# EAGLE schematic btle_board_R0_1 (EAGLE 6.6.0)
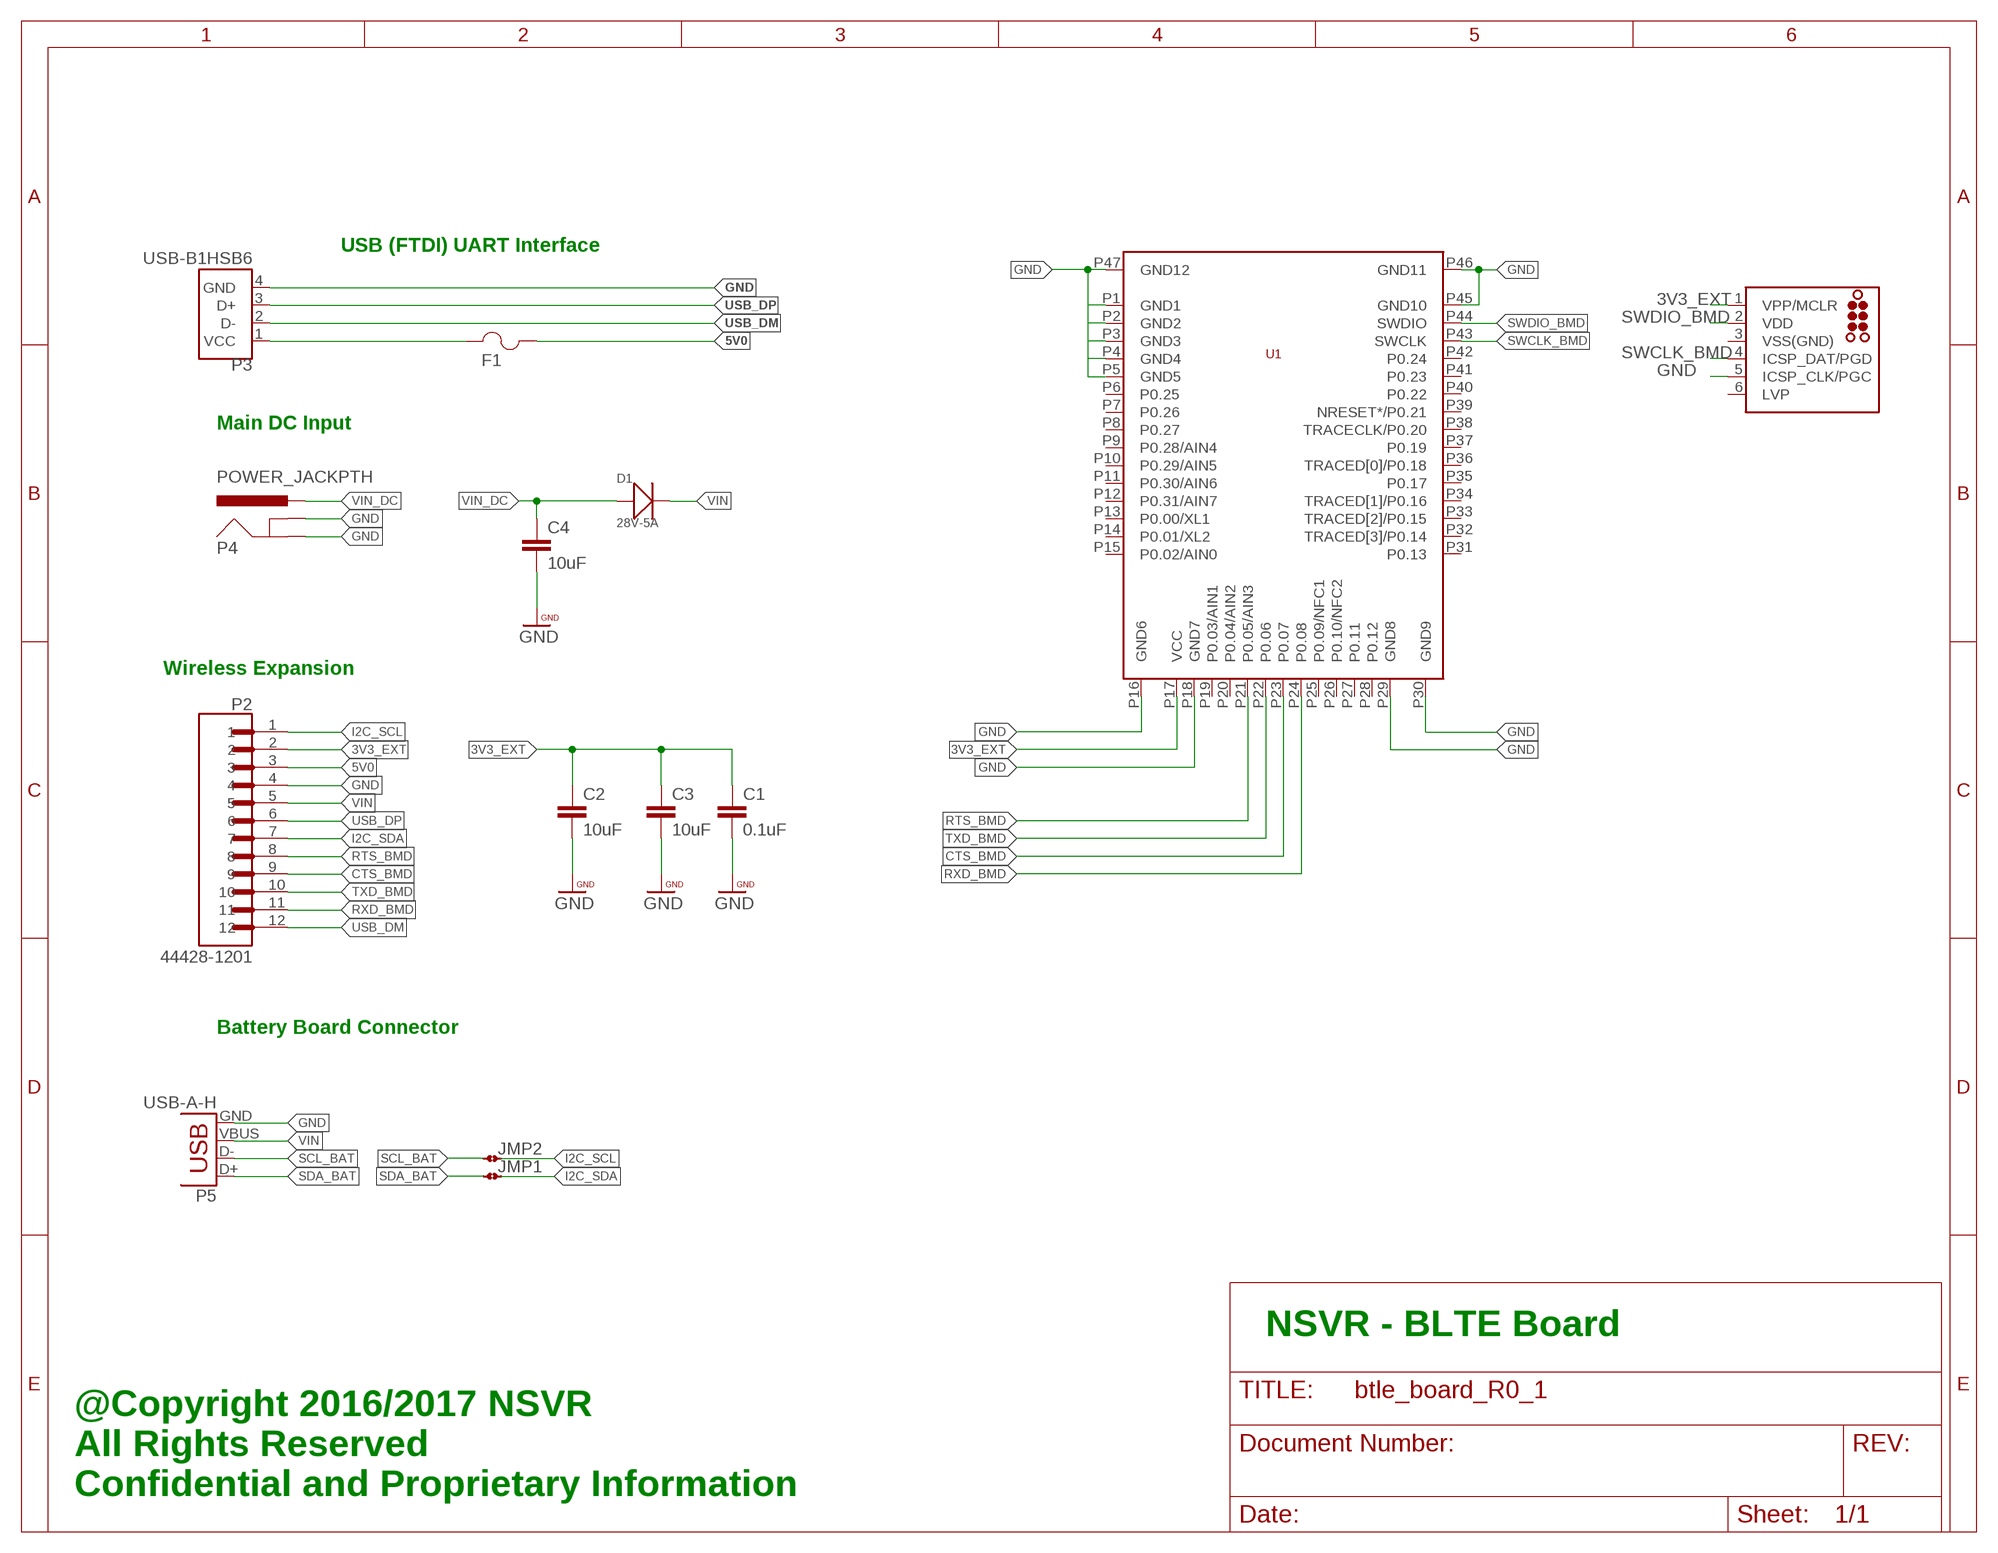
[diagram p0: schematic, sheet 1]

## Parts
C1  0.1uF  CAP0603-CAP  [0603-CAP]
C2  10uF  CAP0603-CAP  [0603-CAP]
C3  10uF  CAP0603-CAP  [0603-CAP]
C4  10uF  CAP0603-CAP  [0603-CAP]
D1  28V-5A  SMD-DIODE-SCHOTTKY-28V-5A(DO-214AA)  [DO-214AA]
F1  1206L050YR  [1206LSERIES]
JMP1  JMP-2-NO-0402  [JMP-2-NO-0402]
JMP2  JMP-2-NO-0402  [JMP-2-NO-0402]
P1  TC2030-MCP-NL  [TC2030-MCP-NL]
P2  44428-1201  [MOLEX_44428-1201]
P3  USB-B1HSB6  [OST_USB-B1HSB6]
P4  POWER_JACKPTH  [POWER_JACK_PTH]
P5  USB-A-H  [USB-A-H]
U1  BMD-300  [BMD-300]

## Nets
3V3_EXT: C1.1 C2.1 C3.1 P1.1(VPP/MCLR) P2.2 U1.P17(VCC)
5V0: F1.2 P2.3
CTS_BMD: P2.9 U1.P23(P0.07)
GND: C1.2 C2.2 C3.2 C4.2 P1.5(ICSP_CLK/PGC) P2.4 P3.4(GND) P4.GND P4.GNDBREAK P5.GND U1.P1(GND1) U1.P2(GND2) U1.P3(GND3) U1.P4(GND4) U1.P5(GND5) U1.P16(GND6) U1.P18(GND7) U1.P29(GND8) U1.P30(GND9) U1.P45(GND10) U1.P46(GND11) U1.P47(GND12)
I2C_SCL: JMP2.2 P2.1
I2C_SDA: JMP1.2 P2.7
RTS_BMD: P2.8 U1.P21(P0.05/AIN3)
RXD_BMD: P2.11 U1.P24(P0.08)
SCL_BAT: JMP2.1 P5.D-
SDA_BAT: JMP1.1 P5.D+
SWCLK_BMD: P1.4(ICSP_DAT/PGD) U1.P43(SWCLK)
SWDIO_BMD: P1.2(VDD) U1.P44(SWDIO)
TXD_BMD: P2.10 U1.P22(P0.06)
USB_DM: P2.12 P3.2(D-)
USB_DP: P2.6 P3.3(D+)
VBUS_IN: F1.1 P3.1(VCC)
VIN: D1.- P2.5 P5.VBUS
VIN_DC: C4.1 D1.+ P4.PWR
Unconnected: P1.6(LVP) U1.P6(P0.25) U1.P7(P0.26) U1.P8(P0.27) U1.P9(P0.28/AIN4) U1.P10(P0.29/AIN5) U1.P11(P0.30/AIN6) U1.P12(P0.31/AIN7) U1.P13(P0.00/XL1) U1.P14(P0.01/XL2) U1.P15(P0.02/AIN0) U1.P19(P0.03/AIN1) U1.P20(P0.04/AIN2) U1.P25(P0.09/NFC1) U1.P26(P0.10/NFC2) U1.P27(P0.11) U1.P28(P0.12) U1.P31(P0.13) U1.P32(TRACED[3]/P0.14) U1.P33(TRACED[2]/P0.15) U1.P34(TRACED[1]/P0.16) U1.P35(P0.17) U1.P36(TRACED[0]/P0.18) U1.P37(P0.19) U1.P38(TRACECLK/P0.20) U1.P39(NRESET*/P0.21) U1.P40(P0.22) U1.P41(P0.23) U1.P42(P0.24)

## Notes on the sheet
- USB (FTDI) UART Interface
- Main DC Input
- Wireless Expansion
- Battery Board Connector
- NSVR - BLTE Board
- @Copyright 2016/2017 NSVR
  All Rights Reserved
  Confidential and Proprietary Information

## Power pins joined to a net without a drawn wire
VSS(GND): P1.3(VSS(GND))

## Library data of the parts
C1-C4 = PatternAgents-ProtoPads:CAP: Capacitor Standard 0603 ceramic capacitor, and 0.1" leaded capacitor.
D1 = Seeed-Diode-2016:SMD-DIODE-SCHOTTKY-28V-5A(DO-214AA): 304020021; MPN: SS54B
F1 = 1206L050:1206L050YR; COPYRIGHT: Copyright C 2015 Accelerated Designs. All rights reserved; MANUFACTURER_PART_NUMBER: 1206L050YR; VENDOR: Littelfuse Inc
JMP1 JMP2 = PatternAgents-ProtoPads:JMP-2-NO: Two Terminal Jumper - Normally Open Positions 1 and 2 are normally NOT connected. PatternAgents ProtoPads Library Schematic and PCB layout libraries for design patterns by PatternAgents. For the CADSoft Eagle CAD program : http://www.cadsoftusa.com/download-eagle/ Source LBR : http://www.patternagents.com Github : https://github.com/PatternAgents License : http://creativecommons.org/licenses/by-sa/4.0/ (Creative Commons 4.0) THIS SOFTWARE IS PROVIDED BY THE CONTRIBUTORS "AS IS" AND WITHOUT ANY EXPRESS OR IMPLIED WARRANTIES, INCLUDING, BUT NOT LIMITED TO, THE IMPLIED WARRANTIES OF MERCHANTABILITY AND FITNESS FOR A PARTICULAR PURPOSE ARE DISCLAIMED. IN NO EVENT SHALL THE COPYRIGHT OWNER OR CONTRIBUTORS BE LIABLE FOR ANY DIRECT, INDIRECT, INCIDENTAL, SPECIAL, EXEMPLARY, OR CONSEQUENTIAL DAMAGES (INCLUDING, BUT NOT LIMITED TO, PROCUREMENT OF SUBSTITUTE GOODS OR SERVICES; LOSS OF USE, DATA, OR PROFITS; OR BUSINESS INTERRUPTION) HOWEVER CAUSED AND ON ANY THEORY OF LIABILITY, WHETHER IN CONTRACT, STRICT LIABILITY, OR TORT (INCLUDING NEGLIGENCE OR OTHERWISE) ARISING IN ANY WAY OUT OF THE USE OF THIS SOFTWARE, EVEN IF ADVISED OF THE POSSIBILITY OF SUCH DAMAGE.; BOM: EXCLUDE
P1 = tag-connect:TC2030: TAG-CONNECT ICSP Connector Manufacturer: Tag-Connect <http://www.tag-connect.com> Cable for easy In-Circuit Serial Programming. Designed for Microchip ICD2, suitable for many others. Two variants - one "with legs" (for hands-free fit on PCB) and another "without legs" for quick programming. PAD Description 1 MCLR/Vpp 2 Vdd 3 GND 4 PGD (ISPDAT) 5 PGC (ISPCLK) 6 nc (used for LVP) ©2009 ROFA.cz - modified and updated by Robert Darlington ‹rdarlington@gmail.com›
P2 = 44428-1201:44428-1201: Conn Wire to Board HDR 12 POS 3mm Solder RA Thru-Hole Micro-Fit 3.0 BMI? Tray; AVAILABILITY: Good; DESCRIPTION: Conn Wire to Board HDR 12 POS 3mm Solder RA Thru-Hole Micro-Fit 3.0 BMI? Tray; MF: Molex; MP: 44428-1201; PACKAGE: None; PRICE: 2.39 USD
P3 = USB-B1HSB6:USB-B1HSB6: Conn Usb Type b r/a Black; AVAILABILITY: Warning; DESCRIPTION: Conn Usb Type b r/a Black; MF: On Shore Technology; MP: USB-B1HSB6; PACKAGE: None; PRICE: 0.42 USD
P4 = SparkFun-Connectors:POWER_JACK: Power Jack This is the standard 5.5mm barrel jack for power. The PTH is the most common, proven, reliable, footprint. The Slot footprint only works if the mill layer is transmitted to the PCB fab house so be warned. Mating wall wart : TOL-00298 (and others); PROD_ID: CONN-08197
P5 = SparkFun-Connectors:USB: USB Connectors USB-B-PTH is fully proven SKU : PRT-00139/CONN-08278 USB-miniB is fully proven SKU : PRT-00587 USB-A-PCB is untested. USB-A-H is throughly reviewed, but untested. Spark Fun Electronics SKU : PRT-00437 USB-B-SMT is throughly reviewed, but untested. Needs silkscreen touching up. USB-A-S has not been used/tested USB-MB-H has not been used/tested USB-MICROB has been used. CONN-09505; PROD_ID: CONN-08367
U1 = BMD-300:BMD-300